# Altium schematic sheet T-Type_System.SchDoc: <Document>
size Letter; Engineer: <Engineer>; Organization: UPEL; Address1: USU Power Electronics Lab; Address2: USTAR Building 620, RM 118; Address3: 1600 N 620 E; Address4: North Logan, UT 84341; DocumentNumber: 8; Revision: v1; SheetNumber: 8; SheetTotal: 16; ProjectName: <Project>
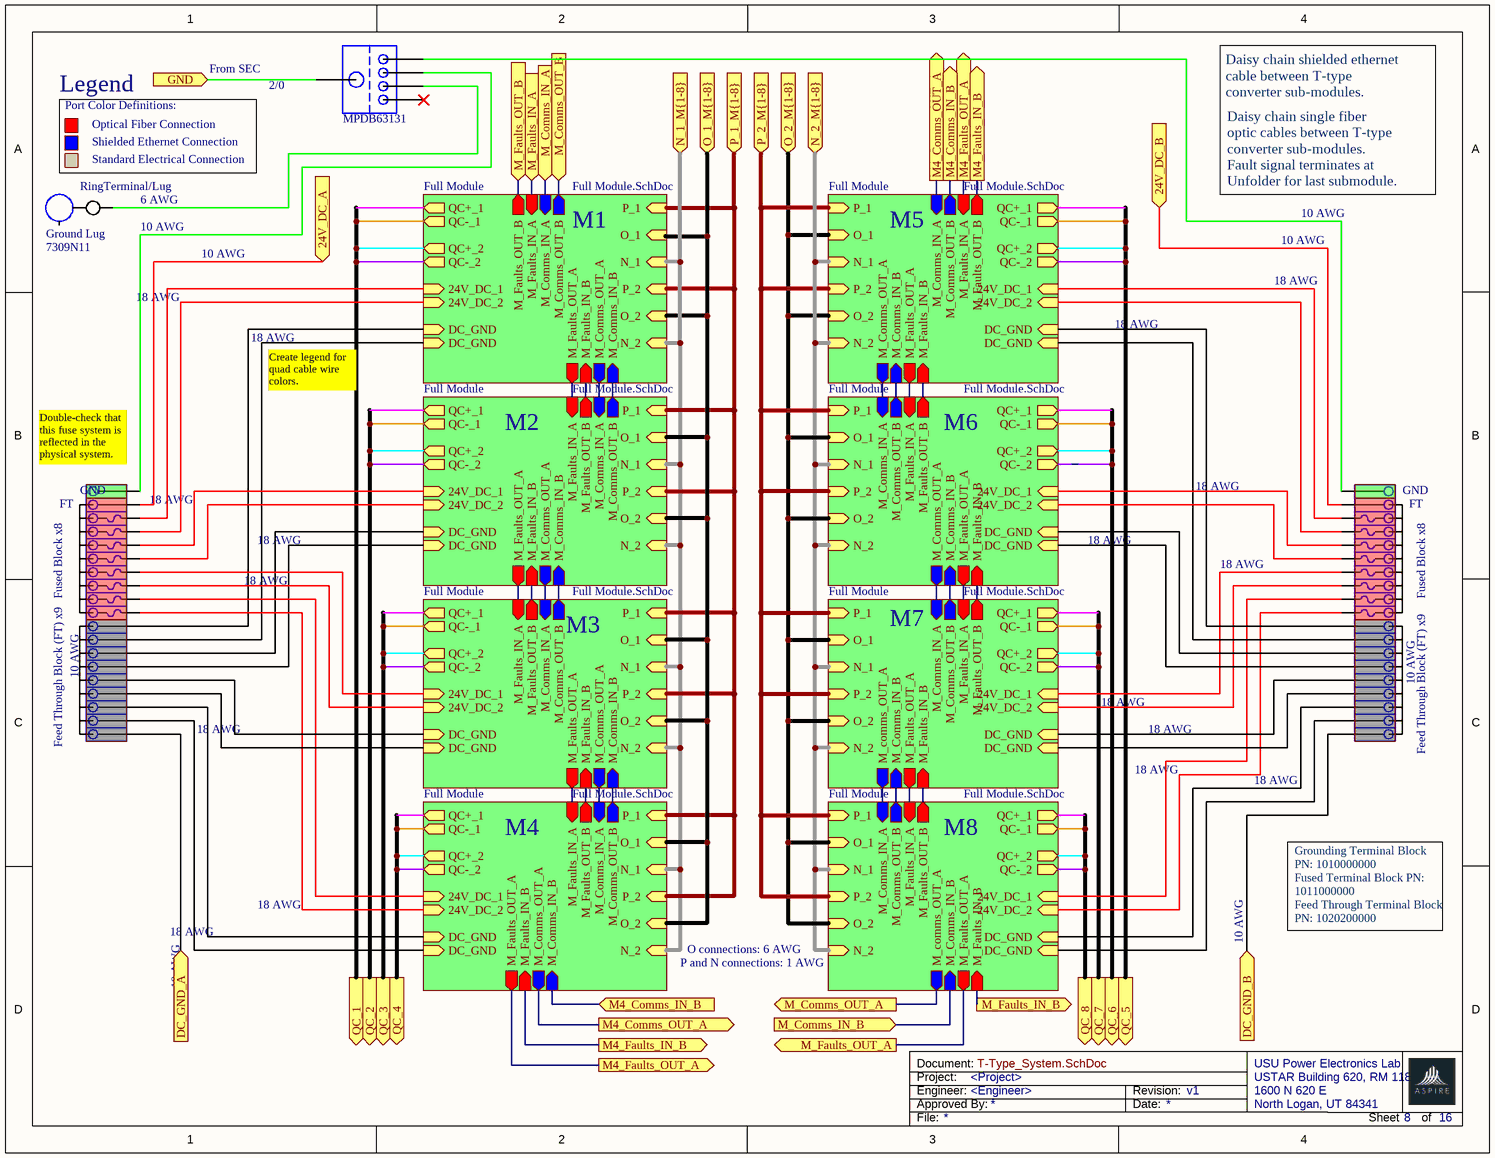
[diagram p0: T-Type_System.SchDoc]

## Parts
(Parts that share a designator on the sheet are numbered #1, #2 ... from top to bottom, then left to right.)
7309N11  Ground Lug
*  RingTerminal/Lug
J?#1  MPDB63131
J?#2  8_pos_terminal  (value not drawn)
J?#3  8_pos_terminal  (value not drawn)

## Sub-sheets
Full Module = Full Module.SchDoc: M_Faults_IN_B (in), M_Comms_OUT_A (out), M_Faults_IN_A (in), M_Comms_IN_A (in), P_1 (in), O_1 (in), N_1 (in), QC+_1 (out), QC-_1 (out), P_2 (in), O_2 (in), N_2 (in), QC+_2 (out), QC-_2 (out), DC_GND (in), 24V_DC_2 (in), 24V_DC_1 (in), DC_GND (in), M_Comms_OUT_B (out), M_Comms_IN_B (in), M_Faults_OUT_A (out), M_Faults_OUT_B (out)
Full Module = Full Module.SchDoc: M_Faults_IN_B (in), M_Comms_OUT_A (out), M_Faults_OUT_B (out), M_Comms_IN_A (in), P_1 (in), O_1 (in), N_1 (in), QC+_1 (out), QC-_1 (out), P_2 (in), O_2 (in), N_2 (in), QC+_2 (out), QC-_2 (out), DC_GND (in), DC_GND (in), 24V_DC_1 (in), 24V_DC_2 (in), M_Comms_OUT_B (out), M_Comms_IN_B (in), M_Faults_IN_A (in), M_Faults_OUT_A (out)
Full Module = Full Module.SchDoc: M_Faults_IN_B (in), M_comms_OUT_A (out), M_Faults_OUT_B (out), M_Comms_IN_A (in), P_1 (in), O_1 (in), N_1 (in), QC+_1 (out), QC-_1 (out), P_2 (in), O_2 (in), N_2 (in), QC+_2 (out), QC-_2 (out), DC_GND (in), DC_GND (in), 24V_DC_2 (in), 24V_DC_1 (in), M_Comms_OUT_B (out), M_Comms_IN_B (in), M_Faults_OUT_A (out), M_Faults_IN_A (in)
Full Module = Full Module.SchDoc: M_Faults_OUT_A (out), M_comms_OUT_A (out), M_Faults_OUT_B (out), M_Comms_IN_A (in), P_1 (in), O_1 (in), N_1 (in), QC+_1 (out), QC-_1 (out), P_2 (in), O_2 (in), N_2 (in), QC+_2 (out), QC-_2 (out), DC_GND (in), DC_GND (in), 24V_DC_2 (in), 24V_DC_1 (in), M_Comms_OUT_B (out), M_Comms_IN_B (in), M_Faults_IN_A (in), M_Faults_IN_B (in)
Full Module = Full Module.SchDoc: M_Faults_OUT_A (out), M_Comms_OUT_A (out), M_Faults_IN_A (in), M_Comms_IN_A (in), P_1 (in), O_1 (in), N_1 (in), QC+_1 (out), QC-_1 (out), P_2 (in), O_2 (in), N_2 (in), QC+_2 (out), QC-_2 (out), DC_GND (in), 24V_DC_2 (in), 24V_DC_1 (in), DC_GND (in), M_Comms_OUT_B (out), M_Comms_IN_B (in), M_Faults_OUT_B (out), M_Faults_IN_B (in)
Full Module = Full Module.SchDoc: M_Faults_OUT_A (out), M_Comms_OUT_A (out), M_Faults_IN_A (in), M_Comms_IN_A (in), P_1 (in), O_1 (in), N_1 (in), QC+_1 (out), QC-_1 (out), P_2 (in), O_2 (in), N_2 (in), QC+_2 (out), QC-_2 (out), DC_GND (in), DC_GND (in), 24V_DC_1 (in), 24V_DC_2 (in), M_Comms_OUT_B (out), M_Comms_IN_B (in), M_Faults_OUT_B (out), M_Faults_IN_B (in)
Full Module = Full Module.SchDoc: M_Faults_OUT_A (out), M_Comms_OUT_A (out), M_Faults_IN_A (in), M_Comms_IN_A (in), P_1 (in), O_1 (in), N_1 (in), QC+_1 (out), QC-_1 (out), P_2 (in), O_2 (in), N_2 (in), QC+_2 (out), QC-_2 (out), DC_GND (in), DC_GND (in), 24V_DC_2 (in), 24V_DC_1 (in), M_Comms_OUT_B (out), M_Comms_IN_B (in), M_Faults_OUT_B (out), M_Faults_IN_B (in)
Full Module = Full Module.SchDoc: M_Faults_OUT_A (out), M_Comms_OUT_A (out), M_Faults_IN_A (in), M_Comms_IN_A (in), P_1 (in), O_1 (in), N_1 (in), QC+_1 (out), QC-_1 (out), P_2 (in), O_2 (in), N_2 (in), QC+_2 (out), QC-_2 (out), DC_GND (in), DC_GND (in), 24V_DC_2 (in), 24V_DC_1 (in), M_Comms_OUT_B (out), M_Comms_IN_B (in), M_Faults_IN_B (in), M_Faults_OUT_B (out)

## Ports
24V_DC_A (in), 24V_DC_B (in), DC_GND_A (in), DC_GND_B (in), GND (in), M4_Comms_IN_B (in), M4_Comms_IN_B (out), M4_Comms_OUT_A (out), M4_Faults_IN_B (out), M4_Faults_OUT_A (out), M_Comms_IN_A (in), M_Comms_IN_B (in), M_Comms_OUT_A (out), M_Comms_OUT_B (in), M_Faults_IN_A (in), M_Faults_IN_B (out), M_Faults_OUT_A (out), M_Faults_OUT_B (in), N_1_M{1-8} (in), N_2_M{1-8} (in), O_1_M{1-8} (in), O_2_M{1-8} (in), P_1_M{1-8} (in), P_2_M{1-8} (in), QC_1 (out), QC_2 (out), QC_3 (out), QC_4 (out), QC_5 (out), QC_6 (out), QC_7 (out), QC_8 (out)

## Nets
24V_DC_A: J?#2.3 ; port 24V_DC_A
24V_DC_B: J?#3.3 ; port 24V_DC_B
DC_GND_A: J?#2.1 ; port DC_GND_A
DC_GND_B: J?#3.1 ; port DC_GND_B
GND: J?#1.0 ; port GND
M4_Comms_IN_B: port M4_Comms_IN_B, sheet Full Module/M_Comms_OUT_B, sheet Full Module/M_Comms_IN_B
M4_Comms_OUT_A: port M4_Comms_OUT_A, sheet Full Module/M_Comms_IN_A, sheet Full Module/M_Comms_OUT_A
M4_Faults_IN_B: port M4_Faults_IN_B, sheet Full Module/M_Faults_OUT_B, sheet Full Module/M_Faults_IN_B
M4_Faults_OUT_A: port M4_Faults_OUT_A, sheet Full Module/M_Faults_IN_A, sheet Full Module/M_Faults_OUT_A
M_Comms_IN_A: port M_Comms_IN_A, sheet Full Module/M_Comms_IN_A
M_Comms_IN_B: port M_Comms_IN_B, sheet Full Module/M_Comms_IN_B
M_Comms_OUT_A: port M_Comms_OUT_A, sheet Full Module/M_comms_OUT_A
M_Comms_OUT_B: port M_Comms_OUT_B, sheet Full Module/M_Comms_OUT_B
M_Faults_IN_A: port M_Faults_IN_A, sheet Full Module/M_Faults_IN_A
M_Faults_IN_B: port M_Faults_IN_B, sheet Full Module/M_Faults_IN_B
M_Faults_OUT_A: port M_Faults_OUT_A, sheet Full Module/M_Faults_OUT_A
M_Faults_OUT_B: port M_Faults_OUT_B, sheet Full Module/M_Faults_OUT_B
N_1_M{1-8}: port N_1_M{1-8}, sheet Full Module/N_1, sheet Full Module/N_2, sheet Full Module/N_1, sheet Full Module/N_2, sheet Full Module/N_1, sheet Full Module/N_2, sheet Full Module/N_1, sheet Full Module/N_2
N_2_M{1-8}: port N_2_M{1-8}, sheet Full Module/N_1, sheet Full Module/N_2, sheet Full Module/N_1, sheet Full Module/N_2, sheet Full Module/N_1, sheet Full Module/N_2, sheet Full Module/N_1, sheet Full Module/N_2
O_1_M{1-8}: port O_1_M{1-8}, sheet Full Module/O_2, sheet Full Module/O_1, sheet Full Module/O_2, sheet Full Module/O_1, sheet Full Module/O_2, sheet Full Module/O_1, sheet Full Module/O_2
O_2_M{1-8}: port O_2_M{1-8}, sheet Full Module/O_1, sheet Full Module/O_2, sheet Full Module/O_1, sheet Full Module/O_2, sheet Full Module/O_1, sheet Full Module/O_2, sheet Full Module/O_1, sheet Full Module/O_2
P_1_M{1-8}: port P_1_M{1-8}, sheet Full Module/P_1, sheet Full Module/P_2, sheet Full Module/P_1, sheet Full Module/P_2, sheet Full Module/P_1, sheet Full Module/P_2, sheet Full Module/P_1, sheet Full Module/P_2
P_2_M{1-8}: port P_2_M{1-8}, sheet Full Module/P_1, sheet Full Module/P_2, sheet Full Module/P_1, sheet Full Module/P_2, sheet Full Module/P_1, sheet Full Module/P_2, sheet Full Module/P_1, sheet Full Module/P_2
QC_1: port QC_1, sheet Full Module/QC+_1, sheet Full Module/QC-_1, sheet Full Module/QC+_2, sheet Full Module/QC-_2
QC_2: port QC_2, sheet Full Module/QC+_1, sheet Full Module/QC-_1, sheet Full Module/QC+_2, sheet Full Module/QC-_2
QC_3: port QC_3, sheet Full Module/QC+_1, sheet Full Module/QC-_1, sheet Full Module/QC+_2, sheet Full Module/QC-_2
QC_4: port QC_4, sheet Full Module/QC+_1, sheet Full Module/QC-_1, sheet Full Module/QC+_2, sheet Full Module/QC-_2
QC_5: port QC_5, sheet Full Module/QC+_1, sheet Full Module/QC-_1, sheet Full Module/QC+_2, sheet Full Module/QC-_2
QC_6: port QC_6, sheet Full Module/QC+_1, sheet Full Module/QC-_1, sheet Full Module/QC+_2, sheet Full Module/QC-_2
QC_7: port QC_7, sheet Full Module/QC+_1, sheet Full Module/QC-_1, sheet Full Module/QC+_2, sheet Full Module/QC-_2
QC_8: port QC_8, sheet Full Module/QC+_1, sheet Full Module/QC-_1, sheet Full Module/QC+_2, sheet Full Module/QC-_2
Net7309N11_5: 7309N11.5 *.2_13
Net*_2_12: *.2_12 J?#1.2
NetJ?#1_4: J?#1.4 J?#2.1
NetJ?#1_5: J?#1.5 J?#3.1
NetJ?#2_1: J?#2.1 ; sheet Full Module/DC_GND
NetJ?#2_1: J?#2.1 ; sheet Full Module/DC_GND  [a separate net that carries the same name]
NetJ?#2_1: J?#2.1 ; sheet Full Module/DC_GND  [a separate net that carries the same name]
NetJ?#2_1: J?#2.1 ; sheet Full Module/DC_GND  [a separate net that carries the same name]
NetJ?#2_1: J?#2.1 ; sheet Full Module/DC_GND  [a separate net that carries the same name]
NetJ?#2_1: J?#2.1 ; sheet Full Module/DC_GND  [a separate net that carries the same name]
NetJ?#2_1: J?#2.1 ; sheet Full Module/DC_GND  [a separate net that carries the same name]
NetJ?#2_1: J?#2.1 ; sheet Full Module/DC_GND  [a separate net that carries the same name]
NetJ?#2_3: J?#2.3 ; sheet Full Module/24V_DC_1
NetJ?#2_3: J?#2.3 ; sheet Full Module/24V_DC_2  [a separate net that carries the same name]
NetJ?#2_3: J?#2.3 ; sheet Full Module/24V_DC_2  [a separate net that carries the same name]
NetJ?#2_3: J?#2.3 ; sheet Full Module/24V_DC_1  [a separate net that carries the same name]
NetJ?#2_3: J?#2.3 ; sheet Full Module/24V_DC_2  [a separate net that carries the same name]
NetJ?#2_3: J?#2.3 ; sheet Full Module/24V_DC_1  [a separate net that carries the same name]
NetJ?#2_3: J?#2.3 ; sheet Full Module/24V_DC_2  [a separate net that carries the same name]
NetJ?#2_3: J?#2.3 ; sheet Full Module/24V_DC_1  [a separate net that carries the same name]
NetJ?#3_1: J?#3.1 ; sheet Full Module/DC_GND
NetJ?#3_1: J?#3.1 ; sheet Full Module/DC_GND  [a separate net that carries the same name]
NetJ?#3_1: J?#3.1 ; sheet Full Module/DC_GND  [a separate net that carries the same name]
NetJ?#3_1: J?#3.1 ; sheet Full Module/DC_GND  [a separate net that carries the same name]
NetJ?#3_1: J?#3.1 ; sheet Full Module/DC_GND  [a separate net that carries the same name]
NetJ?#3_1: J?#3.1 ; sheet Full Module/DC_GND  [a separate net that carries the same name]
NetJ?#3_1: J?#3.1 ; sheet Full Module/DC_GND  [a separate net that carries the same name]
NetJ?#3_1: J?#3.1 ; sheet Full Module/DC_GND  [a separate net that carries the same name]
NetJ?#3_3: J?#3.3 ; sheet Full Module/24V_DC_1
NetJ?#3_3: J?#3.3 ; sheet Full Module/24V_DC_2  [a separate net that carries the same name]
NetJ?#3_3: J?#3.3 ; sheet Full Module/24V_DC_2  [a separate net that carries the same name]
NetJ?#3_3: J?#3.3 ; sheet Full Module/24V_DC_1  [a separate net that carries the same name]
NetJ?#3_3: J?#3.3 ; sheet Full Module/24V_DC_2  [a separate net that carries the same name]
NetJ?#3_3: J?#3.3 ; sheet Full Module/24V_DC_1  [a separate net that carries the same name]
NetJ?#3_3: J?#3.3 ; sheet Full Module/24V_DC_2  [a separate net that carries the same name]
NetJ?#3_3: J?#3.3 ; sheet Full Module/24V_DC_1  [a separate net that carries the same name]
(unnamed): sheet Full Module/M_Faults_IN_B, sheet Full Module/M_Faults_OUT_B
(unnamed): sheet Full Module/M_Comms_OUT_A, sheet Full Module/M_Comms_IN_A
(unnamed): sheet Full Module/M_Comms_IN_B, sheet Full Module/M_Comms_OUT_B
(unnamed): sheet Full Module/M_Faults_OUT_A, sheet Full Module/M_Faults_IN_A
(unnamed): sheet Full Module/M_Faults_IN_B, sheet Full Module/M_Faults_OUT_B
(unnamed): sheet Full Module/M_Comms_OUT_A, sheet Full Module/M_Comms_IN_A
(unnamed): sheet Full Module/M_Comms_IN_B, sheet Full Module/M_Comms_OUT_B
(unnamed): sheet Full Module/M_Faults_OUT_A, sheet Full Module/M_Faults_IN_A
(unnamed): sheet Full Module/M_Faults_IN_B, sheet Full Module/M_Faults_OUT_B
(unnamed): sheet Full Module/M_comms_OUT_A, sheet Full Module/M_Comms_IN_A
(unnamed): sheet Full Module/M_Comms_IN_B, sheet Full Module/M_Comms_OUT_B
(unnamed): sheet Full Module/M_Faults_OUT_A, sheet Full Module/M_Faults_IN_A
(unnamed): sheet Full Module/M_Faults_OUT_A, sheet Full Module/M_Faults_IN_A
(unnamed): sheet Full Module/M_Comms_OUT_A, sheet Full Module/M_Comms_IN_A
(unnamed): sheet Full Module/M_Comms_IN_B, sheet Full Module/M_Comms_OUT_B
(unnamed): sheet Full Module/M_Faults_IN_B, sheet Full Module/M_Faults_OUT_B
(unnamed): sheet Full Module/M_Faults_OUT_A, sheet Full Module/M_Faults_IN_A
(unnamed): sheet Full Module/M_Comms_OUT_A, sheet Full Module/M_Comms_IN_A
(unnamed): sheet Full Module/M_Comms_IN_B, sheet Full Module/M_Comms_OUT_B
(unnamed): sheet Full Module/M_Faults_IN_B, sheet Full Module/M_Faults_OUT_B
(unnamed): sheet Full Module/M_Faults_OUT_A, sheet Full Module/M_Faults_IN_A
(unnamed): sheet Full Module/M_Comms_OUT_A, sheet Full Module/M_Comms_IN_A
(unnamed): sheet Full Module/M_Comms_IN_B, sheet Full Module/M_Comms_OUT_B
(unnamed): sheet Full Module/M_Faults_IN_B, sheet Full Module/M_Faults_OUT_B

Not connected (* = marked no-connect by the designer): J?#1 1*

## Notes on the sheet
- Legend
- From SEC
- 2/0
- Port Color Definitions:
- Optical Fiber Connection
- Shielded Ethernet Connection
- Standard Electrical Connection
- Daisy chain shielded ethernet
  cable between T-type
  converter sub-modules.
- 10 AWG
- 6 AWG
- M1
- M5
- Daisy chain single fiber
  optic cables between T-type
  converter sub-modules.
  Fault signal terminates at
  Unfolder for last submodule.
- 18 AWG
- Create legend for quad cable wire colors.
- M2
- M6
- (near J?#2) Double-check that this fuse system is reflected in the physical system.
- (near J?#2) FT
- (near J?#2) GND
- (near J?#3) GND
- (near J?#3) FT
- (near J?#2) Fused Block x8
- (near J?#2) 10 AWG
- M3
- M7
- (near J?#3) 10 AWG
- (near J?#3) Fused Block x8
- (near J?#2) Feed Through Block (FT) x9
- (near J?#3) Feed Through Block (FT) x9
- M4
- M8
- Grounding Terminal Block PN: 1010000000
- Fused Terminal Block PN: 1011000000
- P and N connections: 1 AWG
- O connections: 6 AWG
- Feed Through Terminal Block PN: 1020200000
- Project:
- Engineer:
- Document:
- Approved By:
- Date:
- Revision:
- File:
- Sheet
- of

## Library data of the parts
7309N11 = 7309N11
J?#1 = 4_to_1
J?#2 J?#3 = Full_Terminal_Block